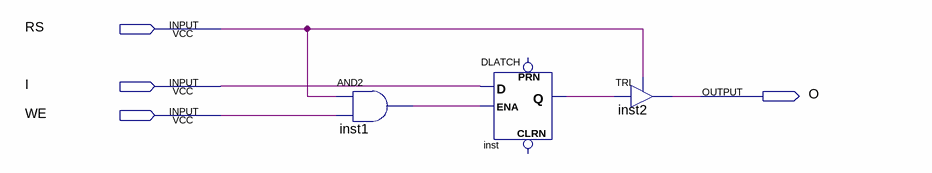
[diagram p0: schematic sheet]
// Quartus schematic MemCell.bdf as structural Verilog: 3 symbols, 4 pins
module MemCell (
  input  RS,
  input  I,
  input  WE,
  output O
);

  wire inst1_out, inst_q;

  and inst1 (inst1_out, RS, WE);
  DLATCH inst (.D(I), .ENA(inst1_out), .Q(inst_q));  // open: CLRN, PRN
  TRI inst2 (.IN(inst_q), .OE(RS), .OUT(O));
endmodule
